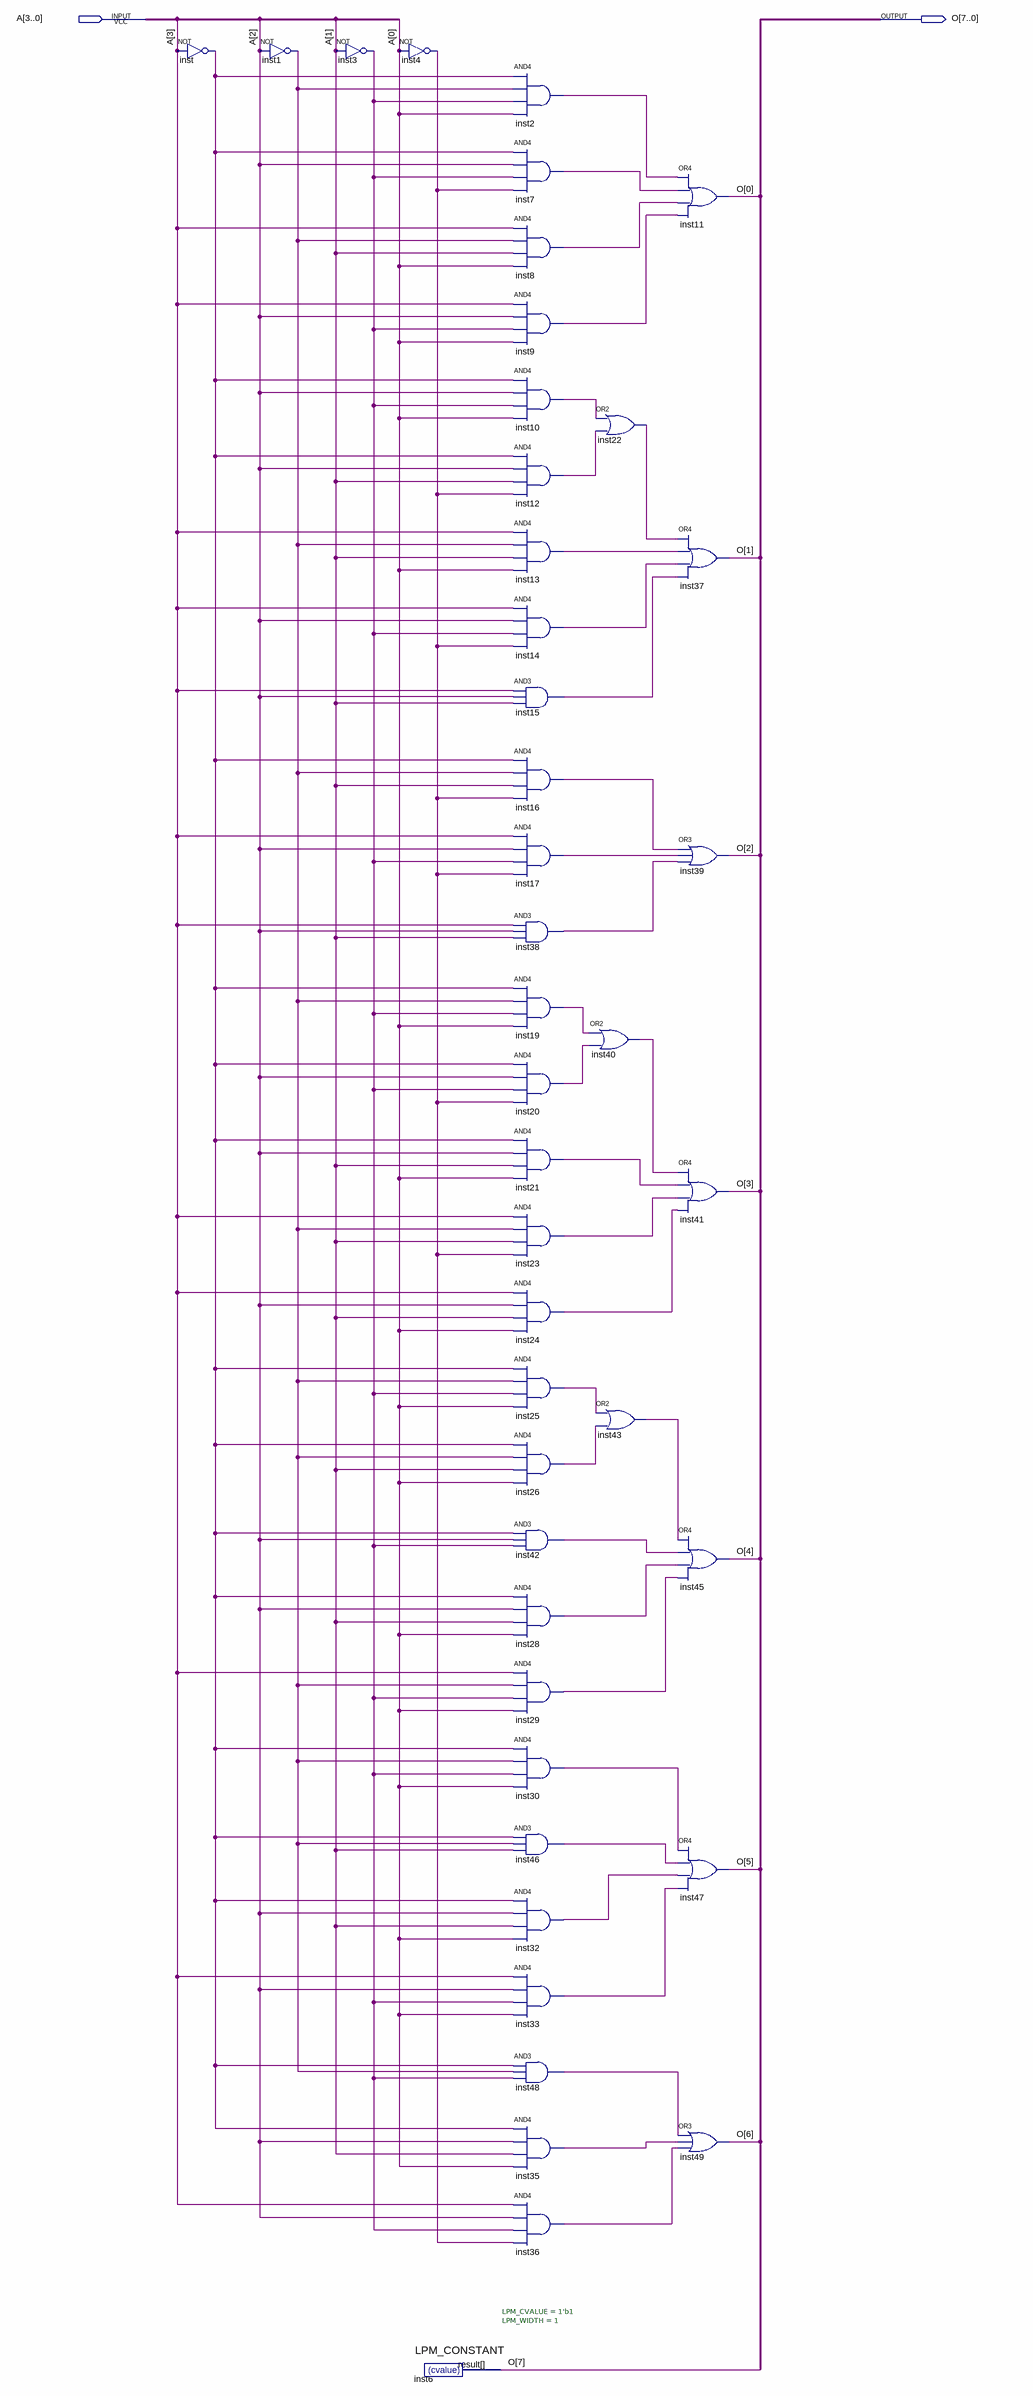
[diagram p0: schematic sheet]
// Quartus schematic sevensegment.bdf as structural Verilog: 44 symbols, 2 pins
module sevensegment (
  input  [3:0] A,
  output [7:0] O
);

  wire inst1_out, inst2_out, inst3_out, inst4_out, inst7_out, inst8_out, inst9_out, inst10_out, inst12_out,
       inst13_out, inst14_out, inst15_out, inst16_out, inst17_out, inst19_out, inst20_out, inst21_out,
       inst22_out, inst23_out, inst24_out, inst25_out, inst26_out, inst28_out, inst29_out, inst30_out,
       inst32_out, inst33_out, inst35_out, inst36_out, inst38_out, inst40_out, inst42_out, inst43_out,
       inst46_out, inst48_out, inst_out;

  not inst (inst_out, A[3]);
  not inst1 (inst1_out, A[2]);
  not inst3 (inst3_out, A[1]);
  not inst4 (inst4_out, A[0]);
  LPM_CONSTANT #(.LPM_CVALUE(1'b1), .LPM_WIDTH(1)) inst6 (.result(O[7]));
  and inst2 (inst2_out, inst_out, inst1_out, inst3_out, A[0]);
  and inst7 (inst7_out, inst_out, A[2], inst3_out, inst4_out);
  and inst8 (inst8_out, A[3], inst1_out, A[1], A[0]);
  and inst9 (inst9_out, A[3], A[2], inst3_out, A[0]);
  and inst10 (inst10_out, inst_out, A[2], inst3_out, A[0]);
  and inst12 (inst12_out, inst_out, A[2], A[1], inst4_out);
  and inst13 (inst13_out, A[3], inst1_out, A[1], A[0]);
  and inst14 (inst14_out, A[3], A[2], inst3_out, inst4_out);
  and inst15 (inst15_out, A[3], A[2], A[1]);
  and inst16 (inst16_out, inst_out, inst1_out, A[1], inst4_out);
  and inst17 (inst17_out, A[3], A[2], inst3_out, inst4_out);
  and inst38 (inst38_out, A[3], A[2], A[1]);
  and inst19 (inst19_out, inst_out, inst1_out, inst3_out, A[0]);
  and inst20 (inst20_out, inst_out, A[2], inst3_out, inst4_out);
  and inst21 (inst21_out, inst_out, A[2], A[1], A[0]);
  and inst23 (inst23_out, A[3], inst1_out, A[1], inst4_out);
  and inst24 (inst24_out, A[3], A[2], A[1], A[0]);
  and inst25 (inst25_out, inst_out, inst1_out, inst3_out, A[0]);
  and inst26 (inst26_out, inst_out, inst1_out, A[1], A[0]);
  and inst42 (inst42_out, inst_out, A[2], inst3_out);
  and inst28 (inst28_out, inst_out, A[2], A[1], A[0]);
  and inst29 (inst29_out, A[3], inst1_out, inst3_out, A[0]);
  and inst30 (inst30_out, inst_out, inst1_out, inst3_out, A[0]);
  and inst46 (inst46_out, inst_out, inst1_out, A[1]);
  and inst32 (inst32_out, inst_out, A[2], A[1], A[0]);
  and inst33 (inst33_out, A[3], A[2], inst3_out, A[0]);
  and inst48 (inst48_out, inst_out, inst1_out, inst3_out);
  and inst35 (inst35_out, inst_out, A[2], A[1], A[0]);
  and inst36 (inst36_out, A[3], A[2], inst3_out, inst4_out);
  or inst22 (inst22_out, inst10_out, inst12_out);
  or inst40 (inst40_out, inst19_out, inst20_out);
  or inst43 (inst43_out, inst25_out, inst26_out);
  or inst11 (O[0], inst2_out, inst7_out, inst8_out, inst9_out);
  or inst37 (O[1], inst22_out, inst13_out, inst14_out, inst15_out);
  or inst39 (O[2], inst16_out, inst17_out, inst38_out);
  or inst41 (O[3], inst40_out, inst21_out, inst23_out, inst24_out);
  or inst45 (O[4], inst43_out, inst42_out, inst28_out, inst29_out);
  or inst47 (O[5], inst30_out, inst46_out, inst32_out, inst33_out);
  or inst49 (O[6], inst48_out, inst35_out, inst36_out);
endmodule
